# Altium schematic sheet PSU_5V.SchDoc
size A4; SheetNumber: 9; SheetTotal: 12
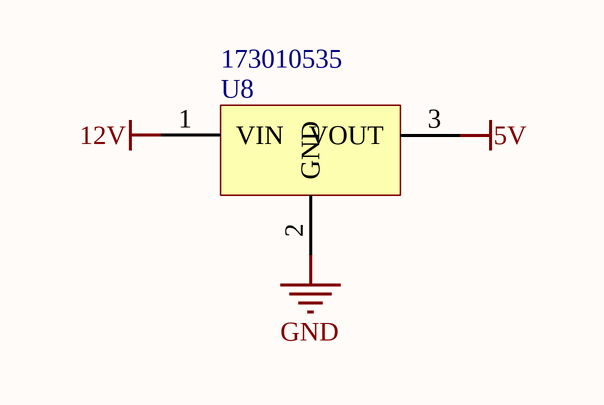
[diagram p0: PSU_5V.SchDoc]

## Parts
U8  173010535  [WPME-FDSM_SIP-3_L11.6W8H10.4]

## Nets
5V: U8.3(VOUT)
12V: U8.1(VIN)
GND: U8.2(GND)

## Library data of the parts
U8 = CMP-019-00019-A05: WPME-FDSM Fixed Step Down Regulator Module, THT, SIP-3, 8-36Vin, 5Vout, 1Aout; Output Current (Continuous): 1A; Input Voltage (Min): 8V; Input Voltage (Max): 36V; Output Voltage (Max): 5V; Component Type: Standard; Height: 10.4mm; Source: WPME-FDSM.SchLib; ComponentLink2URL: https://www.we-online.com/redexpert/spec/173010535?ad; Width: 8mm; Packaging: Tube; Operating Temperature (Min): -40°C; ComponentLink1URL: https://www.we-online.com/redexpert/article/173010535?ad; ComponentLink1Description: Website Link; ComponentLink2Description: Datasheet Link; Category: Step Down Converter; Operating Temperature (Max): 85°C; Pins: 3; Design Item ID: 173010535; Mount: Through Hole; Length: 11.6mm; Match Code: WPME-FDSM; Case/Package: SIP-3